# Altium schematic sheet temp.SchDoc
size A4; SheetNumber: 3; SheetTotal: 8
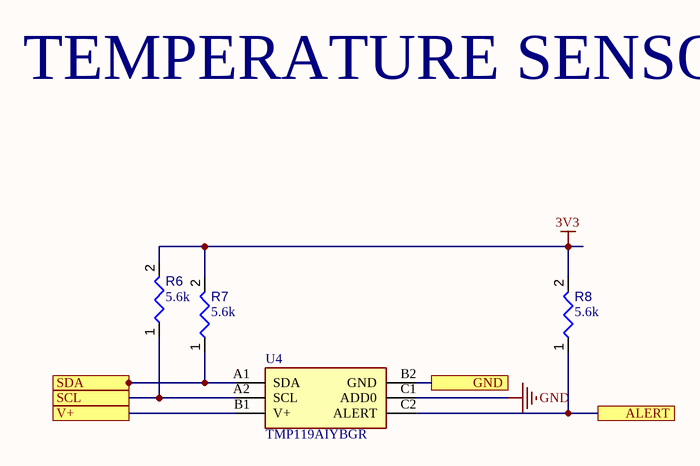
[diagram p0: temp.SchDoc]

## Parts
R6  value 5.6k  [RESC0402(1005)_L]  (hidden comment: Resistor 5K6  +/-5 % 0402 63 mW)
R7  value 5.6k  [RESC0402(1005)_L]  (hidden comment: Resistor 5K6  +/-5 % 0402 63 mW)
R8  value 5.6k  [RESC0402(1005)_L]  (hidden comment: Resistor 5K6  +/-5 % 0402 63 mW)
U4  TMP119AIYBGR  [BGA6C40P2X3_95X149X52]

## Ports
ALERT (see mainsheet[3B]), GND (see mainsheet[4B], MAXREFDES117[2C]), SCL (see mainsheet[3B], ESP32-C3-MINI-1U-H4[2C], MAXREFDES117[1B]), SDA (see mainsheet[3B], ESP32-C3-MINI-1U-H4[2C], MAXREFDES117[1B]), V+ (see mainsheet[4B])

## Nets
3V3: R6.2 R7.2 R8.2
GND: U4.C1(ADD0)
ALERT: R8.1 U4.C2(ALERT) ; port ALERT
GND: U4.B2(GND) ; port GND  [a separate net that carries the same name]
SCL: R6.1 U4.A2(SCL) ; port SCL
SDA: R7.1 U4.A1(SDA) ; port SDA
V+: U4.B1(V+) ; port V+

## Notes on the sheet
- TEMPERATURE SENSOR

## Library data of the parts
R6-R8 = CMP-009-00136-3: Chip Resistor, 5,6 kOhms, +/-5 %, 63 mW, -55 to 155 degC, 0402; Power: 63mW; Tolerance: 5%; Max Operating Temperature: 155°C; Case/Package: 0402; Min Operating Temperature: -55°C; Pins: 2
U4 = TMP119AIYBGR: Integrated Circuit; Manufacturer_Name: Texas Instruments; Datasheet Link: https://www.ti.com/lit/ds/symlink/tmp119.pdf?ts=1711471230059&ref_url=https%253A%252F%252Fwww.ti.com%252Fsitesearch%252Fen-us%252Fdocs%252Funiversalsearch.tsp%253FlangPref%253Den-US%2526searchTerm%253Dtmp119%2526nr%253D70; Height: 0.525mm; Manufacturer_Part_Number: TMP119AIYBGR; Mouser Part Number: 595-TMP119AIYBGR; Mouser Price/Stock: https://www.mouser.co.uk/ProductDetail/Texas-Instruments/TMP119AIYBGR?qs=dbcCsuKDzFUz%2FSabBerKMA%3D%3D